# EAGLE design Minty_Stick_Amp (EAGLE 9.6.2)
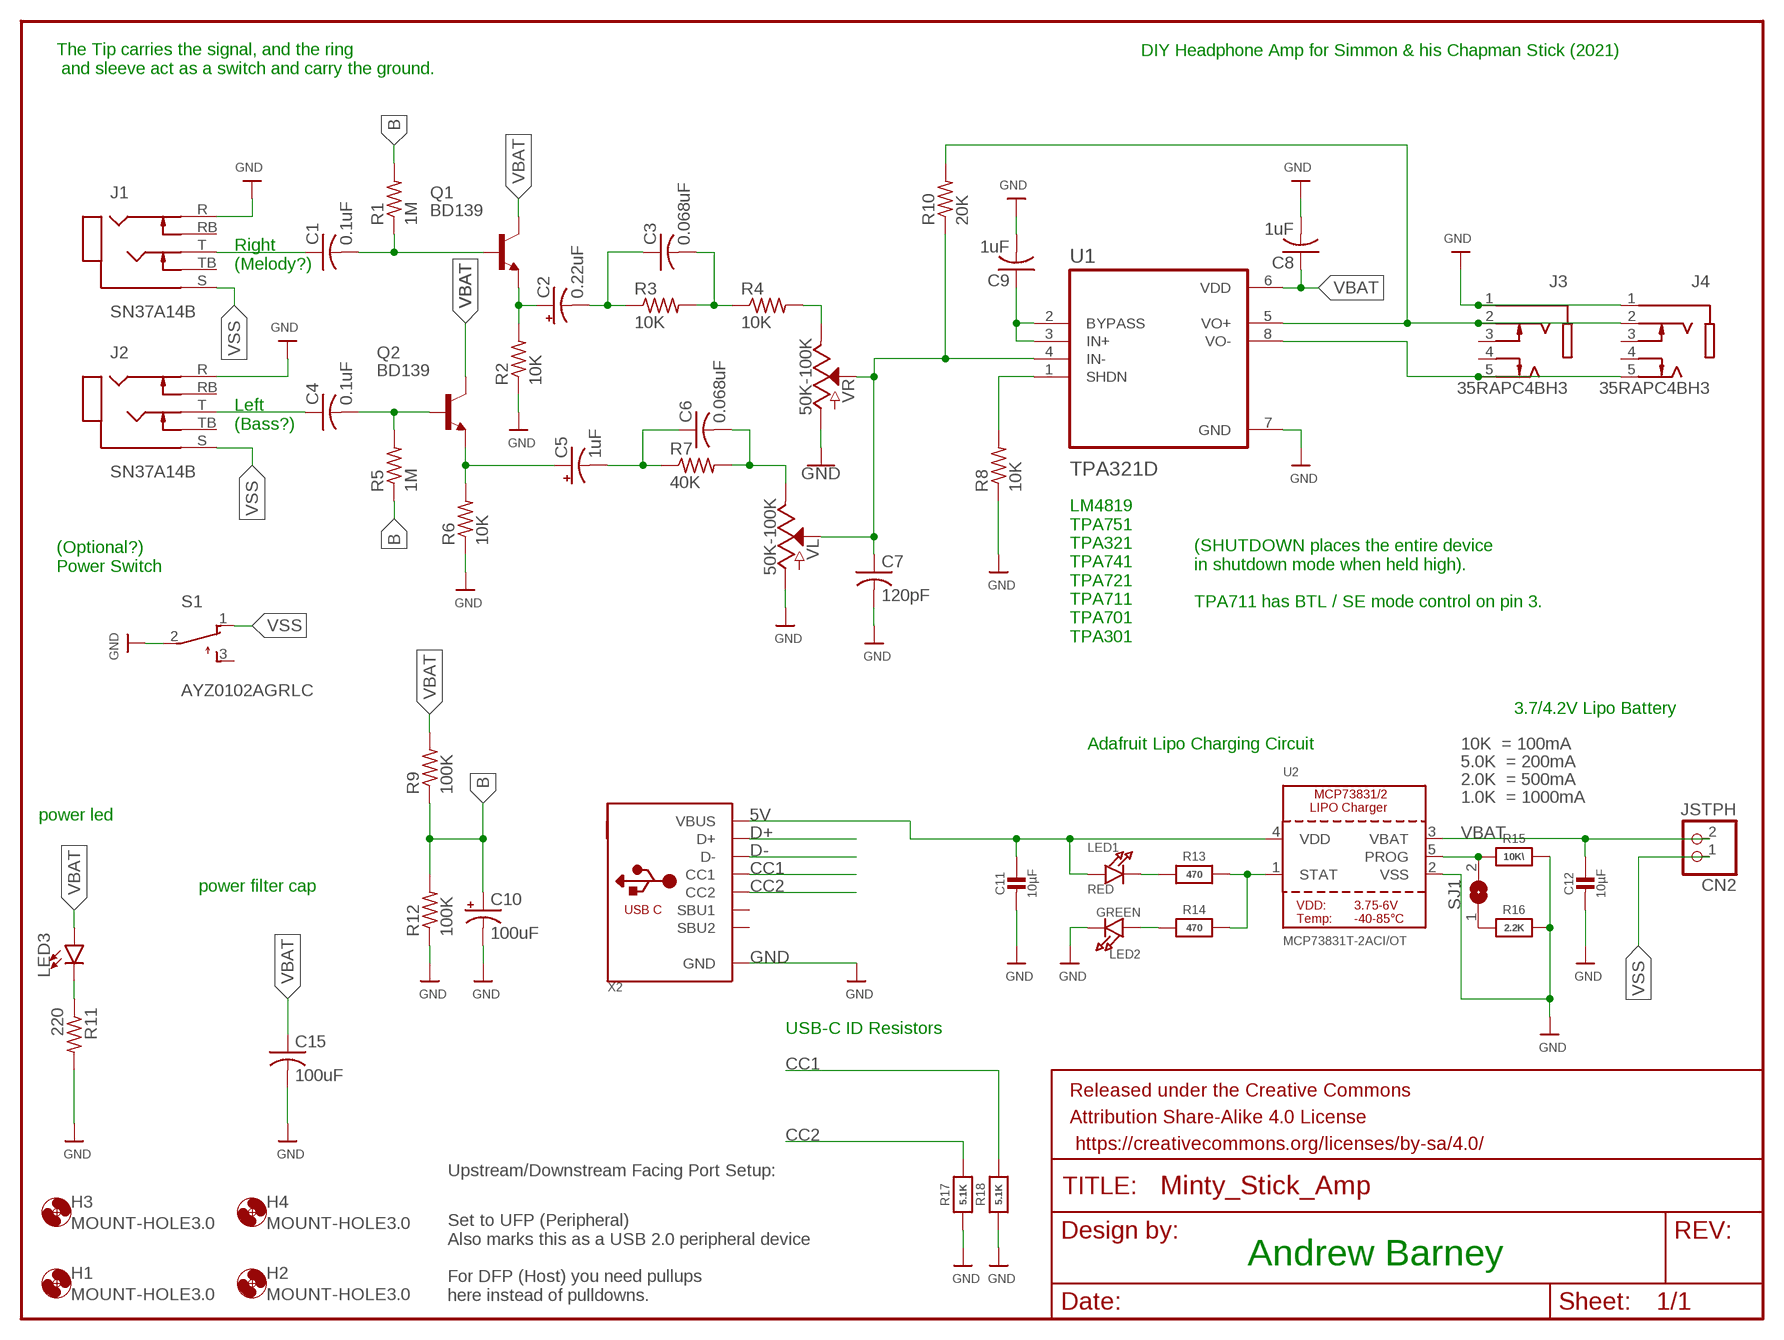
[diagram p0: schematic, sheet 1]

## Parts
C1  0.1uF  C-USC0805K  [C0805K]
C2  0.22uF  CPOL-USE2.5-6  [E2,5-6]
C3  0.068uF  C-USC0805K  [C0805K]
C4  0.1uF  C-USC0805K  [C0805K]
C5  1uF  CPOL-USE2.5-6  [E2,5-6]
C6  0.068uF  C-USC0805K  [C0805K]
C7  120pF  C-USC0805K  [C0805K]
C8  1uF  C-USC0805K  [C0805K]
C9  1uF  C-USC0805K  [C0805K]
C10  100uF  CPOL-USE2.5-6  [E2,5-6]
C11  10µF  CAP_CERAMIC_0805  [_0805]
C12  10µF  CAP_CERAMIC_0805  [_0805]
C15  100uF  C-USC0805K  [C0805K]
CN2  JSTPH  JST_2PIN  [JSTPH2]
FRAME1  FRAME-LETTERNO_PACKAGE  [DUMMY]
H1  MOUNT-HOLE3.0  [3,0]
H2  MOUNT-HOLE3.0  [3,0]
H3  MOUNT-HOLE3.0  [3,0]
H4  MOUNT-HOLE3.0  [3,0]
J1  SN37A14B  [SWITCHCRAFT_SN37A14B]
J2  SN37A14B  [SWITCHCRAFT_SN37A14B]
J3  35RAPC4BH3  [SWITCHCRAFT_35RAPC4BH3]
J4  35RAPC4BH3  [SWITCHCRAFT_35RAPC4BH3]
LED1  RED  LED0805  [CHIPLED_0805]
LED2  GREEN  LED0805  [CHIPLED_0805]
LED3  LED3MM  [LED_3MM]
Q1  BD139  [TO126-V]
Q2  BD139  [TO126-V]
R1  1M  R-US_M0805  [M0805]
R2  10K  R-US_M0805  [M0805]
R3  10K  R-US_M0805  [M0805]
R4  10K  R-US_M0805  [M0805]
R5  1M  R-US_M0805  [M0805]
R6  10K  R-US_M0805  [M0805]
R7  40K  R-US_M0805  [M0805]
R8  10K  R-US_M0805  [M0805]
R9  100K  R-US_M0805  [M0805]
R10  20K  R-US_M0805  [M0805]
R11  220  R-US_FLIPFLOP7  [0805-THM-7]
R12  100K  R-US_M0805  [M0805]
R13  470  RESISTOR_0805  [_0805]
R14  470  RESISTOR_0805  [_0805]
R15  10K\  RESISTOR_0805  [_0805]
R16  2.2K  RESISTOR_0805  [_0805]
R17  5.1K  RESISTOR_0805  [_0805]
R18  5.1K  RESISTOR_0805  [_0805]
S1  AYZ0102AGRLC  [AYZ0102AGRLC]
SJ1  SOLDERJUMPER  [SOLDERJUMPER_ARROW_NOPASTE]
U1  TPA321D  [SOIC127P599X175-8N]
U2  MCP73831T-2ACI/OT  MCP73831/2  [SOT23-5]
VL  50K-100K  POTENTIOMETER-PTH-9MM-1/20W-20%-KIT  [POT-PTH-ALPS-KIT]
VR  50K-100K  POTENTIOMETER-PTH-9MM-1/20W-20%-KIT  [POT-PTH-ALPS-KIT]
X2  USB_C  [USB_C_CUSB31-CFM2AX-01-X]

## Nets
5V: C11.1 LED1.A U2.4(VDD) X2.A4B9(VBUS) X2.B4A9(VBUS)
B: C10.+ R1.2 R5.1 R9.1 R12.2
CC1: R18.2 X2.A5(CC1)
CC2: R17.2 X2.B5(CC2)
D+: X2.A6(D+) X2.B6(D+)
D-: X2.A7(D-) X2.B7(D-)
GND: C7.2 C8.2 C9.2 C10.- C11.2 C12.2 C15.2 J1.R J2.R J3.1 J4.1 LED2.C R2.1 R6.1 R8.1 R11.2 R12.1 R15.2 R16.2 R17.1 R18.1 S1.2 U1.7(GND) U2.2(VSS) VL.P$3(A) VR.P$3(A) X2.A1B12(GND) X2.B1A12(GND)
N$1: C4.1 J2.T
N$2: R8.2 U1.1(SHDN)
N$3: C1.1 J1.T
N$4: C1.2 Q1.B R1.1
N$5: LED3.K(C) R11.1
N$6: C4.2 Q2.B R5.2
N$7: C2.+ Q1.E R2.2
N$8: C5.+ Q2.E R6.2
N$9: C2.- C3.1 R3.1
N$10: LED1.C R13.1
N$11: C3.2 R3.2 R4.1
N$12: C5.- C6.1 R7.1
N$13: C6.2 R7.2 VL.P$1(E)
N$15: C9.1 U1.2(BYPASS) U1.3(IN+)
N$16: R4.2 VR.P$1(E)
N$17: R13.2 R14.2 U2.1(STAT)
N$18: R15.1 SJ1.2 U2.5(PROG)
N$19: C7.1 R10.1 U1.4(IN-) VL.P$2(S) VR.P$2(S)
N$21: LED2.A R14.1
N$22: R16.1 SJ1.1
N$24: J3.2 J4.2 R10.2 U1.5(VO+)
N$25: J3.5 J4.5 U1.8(VO-)
VBAT: C8.1 C12.1 C15.1 CN2.2 LED3.A Q1.C Q2.C R9.2 U1.6(VDD) U2.3(VBAT)
VSS: CN2.1 J1.S J2.S S1.1
Unconnected: J1.RB J1.TB J2.RB J2.TB J3.3 J3.4 J4.3 J4.4 Q1.C2 Q2.C2 S1.3 X2.A8(SBU1) X2.B8(SBU2)

## Notes on the sheet
- DIY Headphone Amp for Simmon & his Chapman Stick (2021)
- The Tip carries the signal, and the ring
   and sleeve act as a switch and carry the ground.
- Right
  (Melody?)
- Left
  (Bass?)
- (Optional?)
  Power Switch
- (SHUTDOWN places the entire device
  in shutdown mode when held high).
  
  TPA711 has BTL / SE mode control on pin 3.
- LM4819
  TPA751
  TPA321
  TPA741
  TPA721
  TPA711
  TPA701
  TPA301
- 3.7/4.2V Lipo Battery
- Adafruit Lipo Charging Circuit | 10K  = 100mA
- 5.0K  = 200mA
- 2.0K  = 500mA
- 1.0K  = 1000mA
- power led
- power filter cap
- USB-C ID Resistors
- Upstream/Downstream Facing Port Setup:
- Andrew Barney
- Set to UFP (Peripheral)
  Also marks this as a USB 2.0 peripheral device
  
  For DFP (Host) you need pullups
  here instead of pulldowns.

## Library data of the parts
C1 C3 C4 C6-C9 C15 = adafruit:C-US: CAPACITOR, American symbol
C2 C5 C10 = adafruit:CPOL-US: POLARIZED CAPACITOR, American symbol
C11 C12 = microbuilder:CAP_CERAMIC: Ceramic Capacitors For new designs, use the packages preceded by an '_' character since they are more reliable: The following footprints should be used on most boards: _0402 - Standard footprint for regular board layouts _0603 - Standard footprint for regular board layouts _0805 - Standard footprint for regular board layouts _1206 - Standard footprint for regular board layouts For extremely tight-pitch boards where space is at a premium, the following 'micro-pitch' footprints can be used (smaller pads, no silkscreen outline, etc.): _0402MP - Micro-pitch footprint for very dense/compact boards _0603MP - Micro-pitch footprint for very dense/compact boards _0805MP - Micro-pitch footprint for very dense/compact boards _1206MP - Micro-pitch footprint for very dense/compact boards
CN2 = microbuilder:JST_2PIN: JST 2-Pin Right-Angle Connector PH-Series - 4UConnector: 17311 SH-Series - 4UConnector: 07278
FRAME1 = SparkFun-Aesthetics:FRAME-LETTER: Schematic Frame - Letter Standard 8.5x11 US Letter frame; DESIGNER: Nobody; VERSION: v01
H1-H4 = holes:MOUNT-HOLE: MOUNTING HOLE with drill center marker
J1 J2 = SN37A14B:SN37A14B: Check prices <https://pricing.snapeda.com/parts/SN37A14B/Switchcraft/view-part?ref=eda>; AVAILABILITY: In Stock; DESCRIPTION: Connector 0.25 Phone Jack Female 3 Position 7.62mm Solder Right Angle Through Hole 6 Terminal 1 Port; MF: Switchcraft; MP: SN37A14B; PACKAGE: None; PRICE: None; PURCHASE-URL: https://pricing.snapeda.com/search/part/SN37A14B/?ref=eda
J3 J4 = 35RAPC4BH3:35RAPC4BH3: 3.50mm (0.141", 1/8", Mini Plug) - Headphone Phone Jack Stereo (3 Conductor, TRS) Connector Solder Check prices <https://pricing.snapeda.com/parts/35RAPC4BH3/Switchcraft%20Inc./view-part?ref=eda>; AVAILABILITY: In Stock; DESCRIPTION: 3.50mm (0.141, 1/8, Mini Plug) - Headphone Phone Jack Stereo (3 Conductor, TRS) Connector Solder; MF: Switchcraft Inc.; MP: 35RAPC4BH3; PACKAGE: None; PRICE: None; PURCHASE-URL: https://pricing.snapeda.com/search/part/35RAPC4BH3/?ref=eda
LED1 LED2 = microbuilder:LED: LED 0603 - 0603 Surface Mount Package 2mA: Green LED - Low Power (3.9mcd, 2ma, 1.7Vf) - Digikey: 475-2709-2-ND Orange LED - Low Power (9.8mcd, 2ma, 1.8Vf) - Digikey: 475-1194-2-ND Red LED - Low Power (5mcd, 2ma, 1.8Vf) - Digikey: 475-1195-2-ND Yellow LED - Low Power (7mcd, 2ma, 1.8Vf) - Digikey: 475-1196-2-ND 5mA: Blue LED - Low Power (17mcd, 5ma, 2.9Vf) - Digikey: LNJ937W8CRACT-ND 0805 - 0805 Surface Mount Package 2mA: Red LED (8.8mcd, 2mA, 1.8Vf, Clear) - Low Power [Digikey: 475-2510-1-ND] Green LED (5mcd, 2mA, 1.8Vf, Clear) - Low Power [Digikey: 475-2730-1-ND] Yellow LED (11.3mcd, 2mA, 1.8Vf, Clear) - Low Power [Digikey: 475-2555-1-ND] 20mA: Red LED (104mcd, 20mA, Diffused) - LS R976 [Digikey: 475-1278-6-ND] Red LED (12mcd, 20mA, 2.0Vf, Clear) - APT2012EC [Digikey: 754-1128-1-ND] Green LED (15mcd, 20mA, 2.2Vf, Clear) - APT2012GC [Digikey: 754-1131-1-ND] Orange LED (160mcd, 20mA, 2.1Vf, Clear) - APT2012SECK [Digikey: 754-1130-1-ND] 1206 - 1206 Surface Mount Package Green LED (26mcd, 20mA, Diffused) - LG N971 [Digikey: 475-1407-6-ND] Red LED (15mcd, 20mA, Diffused) - LH N974 [Digikey: 475-1416-6-ND] Cree - Cree High-Power Surface Mount LEDs XPEBWT-L1-0000-00D50 - White 111lm 350mA 2.9Vf 6200K 110° XTEAWT-00-0000-00000LEE3 - White 114lm 350mA 2.85Vf 5000K 115° Everlight - Everlight 45-21 Series Surface Mount LEDs 45-21/QK2C-B2832AC2CB2/2T - Warm White 2000mcd 20mA 3.25Vf 3050K 120° 45-21/LK2C-B38452C4CB2/2T - Nuetral White 2000mcd 20mA 3.25Vf 4150K 120° 45-21/LK2C-B50634C6CB2/2T - Cold White 2200mcd 20mA 3.25Vf 5650K 120° PLCC2 Reverse Mount LS T77K-J1L2-1-0-2-R18-Z - Red 11.25mcd 2mA 1.8Vf 630nm 120° LO T77K-L1M2-24-Z - Orange 19.6mcd 2mA 1.8Vf 606nm 120° LY T77K-K2M1-26-Z - Yellow 15.7mcd 2mA 1.8Vf 587nm 120°
LED3 = SparkFun-LED:LED: LED (Generic) Standard schematic elements and footprints for 5mm, 3mm, 1206, and 0603 sized LEDs. Generic LEDs with no color specified.; PROD_ID: DIO-08794
Q1 Q2 = BD139:BD139: Check prices <https://pricing.snapeda.com/parts/BD139/STMicroelectronics/view-part?ref=eda>
R1-R12 = adafruit:R-US_: RESISTOR, American symbol
R13-R18 = microbuilder:RESISTOR: Resistors For new designs, use the packages preceded by an '_' character since they are more reliable: The following footprints should be used on most boards: _0402 - Standard footprint for regular board layouts _0603 - Standard footprint for regular board layouts _0805 - Standard footprint for regular board layouts _1206 - Standard footprint for regular board layouts For extremely tight-pitch boards where space is at a premium, the following 'micro-pitch' footprints can be used (smaller pads, no silkscreen outline, etc.): _0402MP - Micro-pitch footprint for very dense/compact boards _0603MP - Micro-pitch footprint for very dense/compact boards _0805MP - Micro-pitch footprint for very dense/compact boards _1206MP - Micro-pitch footprint for very dense/compact boards
S1 = Switch:AYZ0102AGRLC: SWITCH SLIDE SPDT 100MA 12V Manufacturer's datasheet <https://www.ckswitches.com/media/1431/ayz.pdf>; CREATED_BY: PCBLayout.com; DIGIKEY_PARTNO: 401-2012-1-ND; MANUFACTURER: C&K; MPN: AYZ0102AGRLC
SJ1 = microbuilder:SOLDERJUMPER: SMD Solder JUMPER Solder the two pads together to create a connection, or remove the solder to break it. REFLOW - Use this footprint for solder paste and reflow ovens. WAVE - Use this footprint for hand-soldering (larger pads). CLOSED - Has a trace between the two pads to ensure it is closed by default. The trace needs to be cut to disable the jumper, and can be closed again by creating a solder bridge between the two pads.; BOM: EXCLUDE
U1 = TPA321D:TPA321D: Check prices <https://pricing.snapeda.com/parts/TPA321D/Texas%20Instruments/view-part?ref=eda>; AVAILABILITY: In Stock; DESCRIPTION: 350-mW Mono Class-AB Audio Amplifier with Differential Inputs 8-SOIC -40 to 85; MF: Texas Instruments; MP: TPA321D; PACKAGE: SOIC-8 Texas Instruments; PRICE: None; PURCHASE-URL: https://pricing.snapeda.com/search/part/TPA321D/?ref=eda
U2 = microbuilder:MCP73831/2: MCP73831/2 LIPO Charger VDD: 3.75 - 6V Temp -40 - 85°C Programmable Charge Rate: 15-500mA NOTE: STAT is a tri-state logic output on the MCP73831 and an open-drain output on the MCP73832. SOT23-5 with 4.2V output and tri-state logic on STAT = MCP73831T-2ACI/OT
VL VR = SparkFun-Resistors:POTENTIOMETER: Potentiometer (Pot) Three-terminal potentiometers, with an adjustable wiper and two adjustable resistors. A pot can be used to create a configurable voltage divider, or as a variable resistor. Variants ALPS_POT and ALPS_POT_KIT - PTH, breadboard compatible, 9mm square pots Rotary Potentiometer - Linear (10k ohm) <https://www.sparkfun.com/products/9288> (COM-09288) The KIT variant exposes copper on only one side of the PTH pad, so the part can only be assembled on one side of the PCB. Useful for beginner soldering kits.; PROD_ID: RES-09177; SF_SKU: COM-09288; VALUE: 10k
X2 = microbuilder:USB_C: USB Type-C USB 2.0 Connector

## Net classes
0 default: width 0.001 mm

## Board
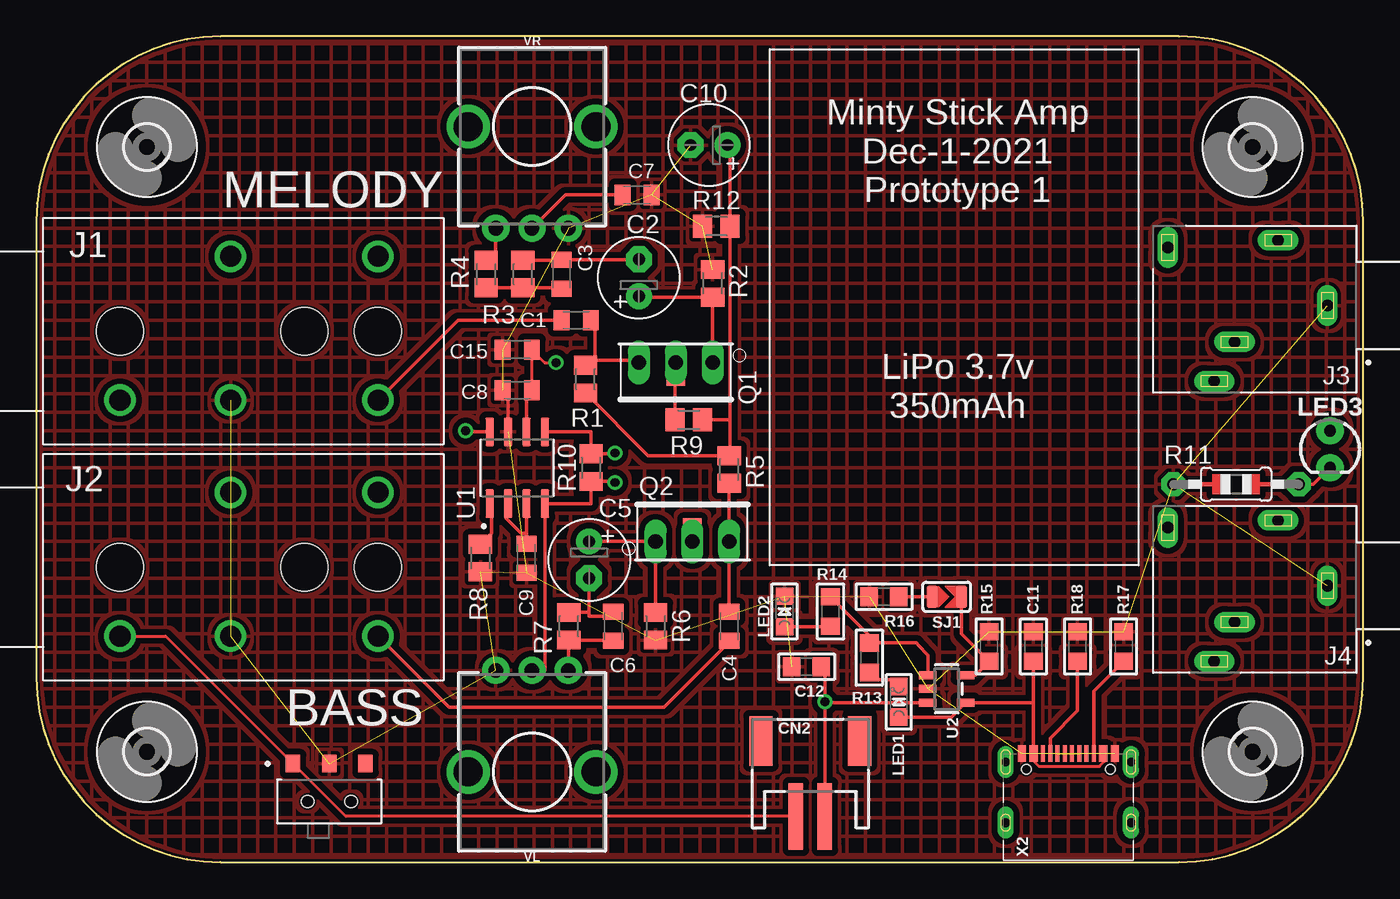
[diagram p1: board, top side]
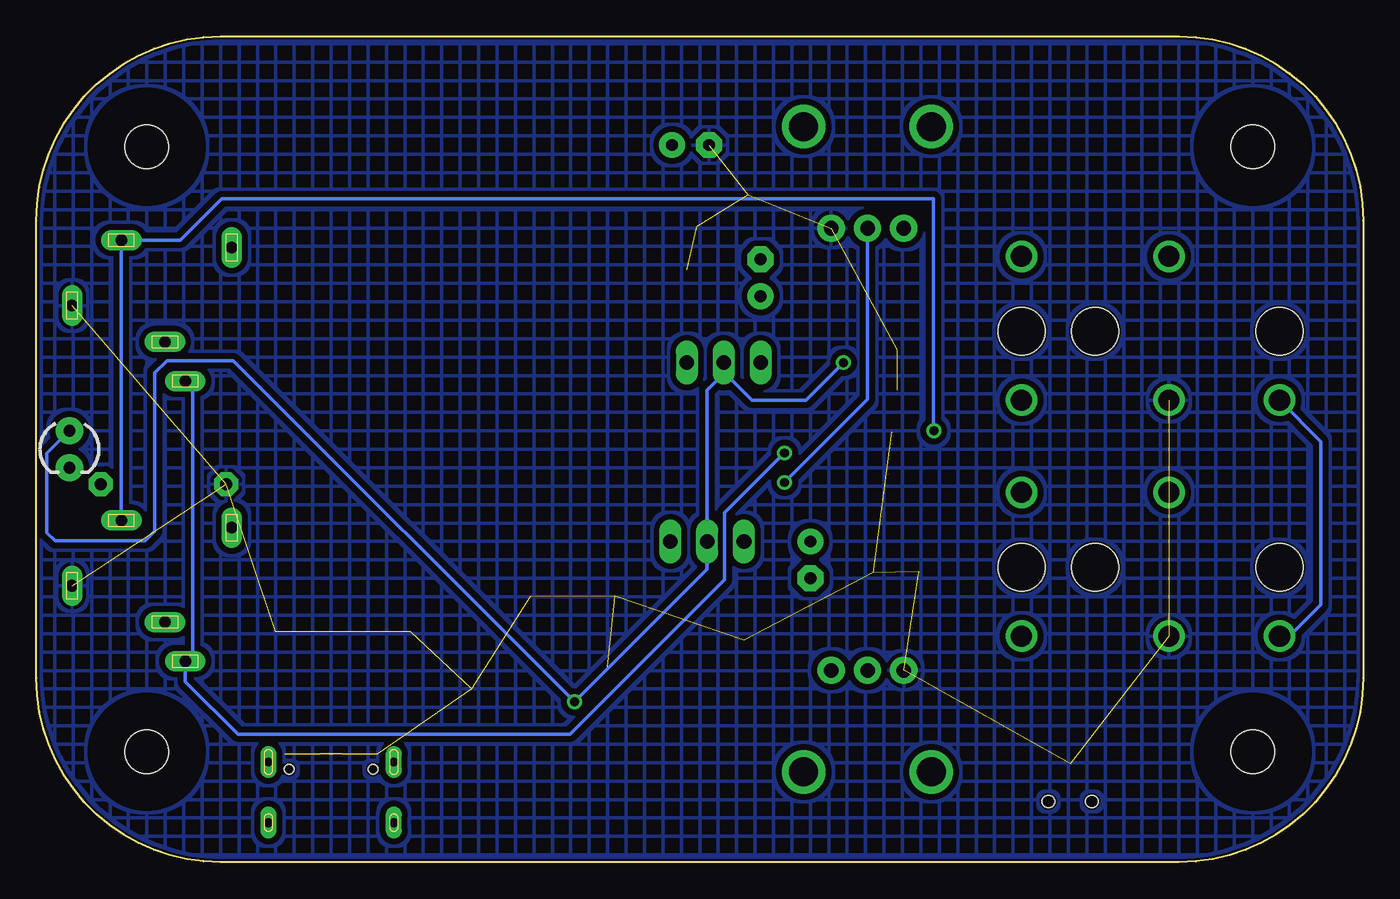
[diagram p2: board, bottom side, seen from below]

Size 91.44 x 56.9 mm. Coordinates in mm from the lower left corner, seen from the top.
Copper layers (1*16): Top 0.035mm / dielectric 1.5mm / Bottom 0.035mm
Design rules "default *": minimum track width 8mil, minimum drill 15.5mil, track to track 16mil, track to pad 8mil, pad to pad 8mil, via to via 8mil, smd to smd 6mil, copper to edge 6mil, drill to drill 6mil, minimum pad ring 10mil, minimum via ring 8mil, stop-mask expansion 2mil, vias tented up to drill 0mil, thermal gap 10mil

### Footprints (pad centres in the part's own frame; a part is rotated, then mirrored left to right if it is on the bottom)
C0805K = smd 1.1 x 1.4: 1 -1,0; 2 1,0
E2,5-6 = drill 0.813 pad 1.778: + -1.27,0 | drill 0.813 pad 1.778 octagon: - 1.27,0
_0805 = smd 1.2 x 1.3: 1 -1.016,0; 2 1.016,0
JSTPH2 = smd 1 x 4.6: 1 -1,-3.7; 2 1,-3.7 | smd 1.6 x 3.4: NC1 -3.4,1.5; NC2 3.4,1.5
3,0 = hole 3: 0,0
SWITCHCRAFT_SN37A14B = drill 1.448: R -2.337,4.75; RB -2.337,-5.156; S 5.283,4.75; T -12.497,4.75; TB -12.497,-5.156 | hole 3.251: 5.283,0; -7.417,0; -12.497,0
SWITCHCRAFT_35RAPC4BH3 = drill 0.8 pad 1.4 long: 1 -3.25,-0.25; 2 4.55,4.95; 3 3.15,2.25; 4 7.75,-4.25; 5 0.15,-4.75
CHIPLED_0805 = smd 1.2 x 1.2: A 0,-1.05; C 0,1.05
LED_3MM = drill 0.813 pad 1.88: A -1.27,0; K 1.27,0
TO126-V = drill 1 long: B 2.54,0; C 0,0; E -2.54,0 | smd 1.27 x 0.635: C2 0,1.27
M0805 = smd 1.3 x 1.6: 1 -0.95,0; 2 0.95,0
0805-THM-7 = drill 0.813 pad 1.676 octagon: 1 -4.318,0; 2 4.318,0
AYZ0102AGRLC = smd 1 x 1.2: 1 -2.5,2.6; 2 0,2.6; 3 2.5,2.6 | hole 0.85: -1.5,0; 1.5,0
SOLDERJUMPER_ARROW_NOPASTE = smd 0.762 x 1.524: 1 -1.016,0; 2 1.016,0
SOIC127P599X175-8N = smd 1.97 x 0.6: 1 -2.47,1.905; 2 -2.47,0.635; 3 -2.47,-0.635; 4 -2.47,-1.905; 5 2.47,-1.905; 6 2.47,-0.635; 7 2.47,0.635; 8 2.47,1.905
SOT23-5 = smd 0.55 x 1.2: 1 -0.95,-1.3; 2 0,-1.3; 3 0.95,-1.3; 4 0.95,1.3; 5 -0.95,1.3
POT-PTH-ALPS-KIT = drill 1 pad 1.88: P$1 7,-2.5; P$2 7,0; P$3 7,2.5 | drill 2: P$4 0,-4.4; P$5 0,4.4
USB_C_CUSB31-CFM2AX-01-X = smd 0.575 x 1.15: A1B12 -3.2,7.355; A4B9 -2.4,7.355; B1A12 3.2,7.355; B4A9 2.4,7.355 | smd 0.275 x 1.15: A5 -1.25,7.355; A6 -0.25,7.355; A7 0.25,7.355; A8 1.25,7.355; B5 1.75,7.355; B6 0.75,7.355; B7 -0.75,7.355; B8 -1.75,7.355 | drill 0.6 pad 1 long: M1 -4.32,6.78; M2 4.32,6.78; M3 -4.32,2.6; M4 4.32,2.6 | hole 0.65: 2.89,6.28; -2.89,6.28

### Placement (x,y rotation side)
C1  37.21,37.34 0 top
C2  41.53,40.26 90 top
C3  36.2,40.51 270 top
C4  47.75,16.26 90 top
C5  38.1,20.83 270 top
C6  39.75,16.26 270 top
C7  41.4,45.97 0 top
C8  33.15,32.51 180 top
C9  33.78,20.95 270 top
C10  46.35,49.4 180 top
C11  68.71,14.86 90 top
C12  53.09,13.46 180 top
C15  33.15,35.31 180 top
CN2  53.34,6.86 0 top
FRAME1  -3.3,-0.25 0 top  (outside the outline)
H1  7.62,7.62 0 top
H2  83.82,7.62 0 top
H3  7.62,49.28 0 top
H4  83.82,49.28 0 top
J1  11.05,36.58 180 top
J2  11.05,20.32 180 top
J3  85.72,38.1 180 top
J4  85.72,18.8 180 top
LED1  59.44,11.05 0 top
LED2  51.56,17.27 0 top
LED3  89.15,28.45 270 top
Q1  44.07,34.42 180 top
Q2  45.21,22.1 0 top
R1  37.85,33.27 270 top
R2  46.61,39.88 270 top
R3  33.53,40.51 270 top
R4  30.99,40.51 90 top
R5  47.75,27.05 270 top
R6  42.67,16.26 90 top
R7  36.7,16.26 270 top
R8  30.61,20.95 90 top
R9  44.96,30.48 180 top
R10  38.23,27.18 90 top
R11  82.68,26.04 180 top
R12  46.86,43.81 0 top
R13  57.4,14.1 90 top
R14  54.74,17.27 90 top
R15  65.66,14.86 90 top
R16  58.42,18.29 180 top
R17  74.93,14.86 270 top
R18  71.75,14.86 270 top
S1  20.19,4.19 0 top
SJ1  62.74,18.29 0 top
U1  33.15,27.18 90 top
U2  62.74,11.94 270 top
U$2  [ALTOIDSTIN-DIM]  45.72,28.45 0 top
VL  34.16,6.22 90 top
VR  34.16,50.67 270 top
X2  71.12,0.13 0 top

### Tracks (layer width: path | path; a pad name or v marks a point on that pad's centre or on a via)
5V
  Top 0.203: X2.A4B9 68.67,7.44 68.67,7.04 69.11,6.6 73.26,6.6 73.61,6.95 73.61,7.39 X2.B4A9
  Top 0.254: LED1.A 63.05,10 U2.4 68.65,10.99 68.72,10.92 | X2.A4B9 68.72,10.92 | 68.72,10.92 C11.1
B
  Top 0.254: 47.81,30.48 R12.2 47.81,49.22 C10.+ | 47.81,30.48 47.81,28.06 R5.1 42.17,28 R1.2 | R9.1 47.81,30.48
CC1
  Top 0.254: R18.2 71.75,10.43 69.87,8.54 X2.A5
CC2
  Top 0.254: X2.B5 72.87,11.78 R17.2
D+  (1 unrouted)
D-  (1 unrouted)
GND  (26 unrouted)
  Top 0.254: C8.2 32.53,32.13 32.53,29.66 U1.7
  pour Bottom (hatched): 12.45,57.15 78.99,57.15 arc-90 91.69,44.45 91.69,12.45 arc-90 78.99,-0.25 12.45,-0.25 arc-90 -0.25,12.45 -0.25,44.45 arc-90
  pour Top (hatched): 12.45,57.15 78.99,57.15 arc-90 91.69,44.45 91.69,12.45 arc-90 78.99,-0.25 12.45,-0.25 arc-90 -0.25,12.45 -0.25,44.45 arc-90
N$1
  Top 0.254: C4.1 47.75,15.17 43.27,10.68 28.43,10.68 J2.T
N$2
  Top 0.254: U1.1 31.37,24.58 31.37,22.67 R8.2
N$3
  Top 0.254: C1.1 29.06,37.34 J1.T
N$4
  Top 0.254: R1.1 37.85,34.29 38.13,34.58 38.38,34.58 38.51,34.58 | Q1.B 41.37,34.58 38.51,34.58 | C1.2 38.51,37.04 38.51,34.58
N$5
  Top 0.254: LED3.K 88.01,26.04 R11.1
N$6
  Top 0.254: C4.2 Q2.B R5.2
N$7
  Top 0.254: C2.+ 41.59,38.93 R2.2 Q1.E
N$8
  Top 0.254: C5.+ Q2.E R6.2
N$9
  Top 0.254: R3.1 36.14,41.46 C3.1 41.51,41.51 C2.-
N$10
  Top 0.254: LED1.C 59.4,12.07 59.09,12.07 59.09,12.57 56.9,12.57 R13.1
N$11
  Top 0.254: R4.1 R3.2 36.14,39.56 C3.2
N$12
  Top 0.254: R7.1 38.1,17.21 | C6.1 39.45,16.95 38.1,16.95 38.1,17.21 | C5.- 38.1,17.21
N$13
  Top 0.254: VL.P$1 36.66,15.31 R7.2 39.7,15.31 C6.2
N$15
  Top 0.254: C9.1 33.78,22.68 | 33.78,22.68 U1.3 | U1.2 32.38,24.58 32.38,23.69 33.4,22.68 33.78,22.68
N$16
  Top 0.254: VR.P$1 31.66,41.46 R4.2
N$17
  Top 0.254: R14.2 57.56,15.47 R13.2 60.65,15.11 60.79,14.96 61.44,14.27 U2.1
N$18
  Top 0.254: 63.78,18.26 SJ1.2 63.75,15.75 R15.1 64.7,12.89 U2.5
N$19  (via drill 0.61)
  Top 0.254: VL.P$2 35.05,13.22 U1.4 38.23,24.71 R10.1 39.81,26.23 v39.88,26.16 | VR.P$2 36.46,45.97 C7.1
  Bottom 0.254: VR.P$2 34.16,31.88 v39.88,26.16
N$21
  Top 0.254: LED2.A 54.7,16.22 R14.1
N$22
  Top 0.254: R16.1 SJ1.1
N$24  (via drill 0.61)
  Top 0.254: U1.5 38.23,29.65 R10.2 39.81,28.13 v39.88,28.19
  Bottom 0.254: J4.2 80.84,14.18 | J3.2 80.67,32.64 80.67,14.35 J4.2 | v39.88,28.19 44,24.07 44,19.46 54.64,8.81 77.54,8.81 81.17,12.45 J4.2
N$25  (via drill 0.61)
  Top 0.254: U1.8 29.66,29.65 v29.59,29.72
  Bottom 0.254: J4.5 J3.5 81.51,42.85 78.66,45.7 29.63,45.7 29.63,29.76 v29.59,29.72
VBAT  (via drill 0.61)
  Top 0.203: C8.1 C15.1 35.04,34.42 v35.81,34.42
  Top 0.254: U1.6 33.78,32.51 C8.1 | R9.2 44.01,34.36 Q1.C | CN2.2 54.34,11.03 | 54.34,11.03 v54.36,11.05 | C12.1 54.34,13.22 54.34,11.03 | U2.3 54.38,10.99 54.34,11.03
  Bottom 0.254: v35.81,34.42 38.41,31.82 42.1,31.82 44.01,33.72 | 44.01,33.72 44.07,33.78 Q1.C | 44.01,33.72 45.21,32.51 Q2.C 45.21,20.19 v54.36,11.05 77.87,34.56 82.43,34.56 83.29,33.7 83.29,22.79 83.94,22.14 90.13,22.14 90.7,22.71 90.7,28.17 LED3.A
VSS
  Top 0.203: J2.S 8.91,15.57 S1.1 21.33,3.16 CN2.1
  Bottom 0.254: J1.S 2.92,28.98 2.92,17.73 5.08,15.57 J2.S

### Text on the board
tPlace: Minty Stick Amp / Dec-1-2021 / Prototype 1 | MELODY | LiPo 3.7v / 350mAh | BASS